# EAGLE design mbed-WiFi-BLE-Cloud-v1.1.0 (EAGLE 7.7.0)

## Sheet 1 of 4
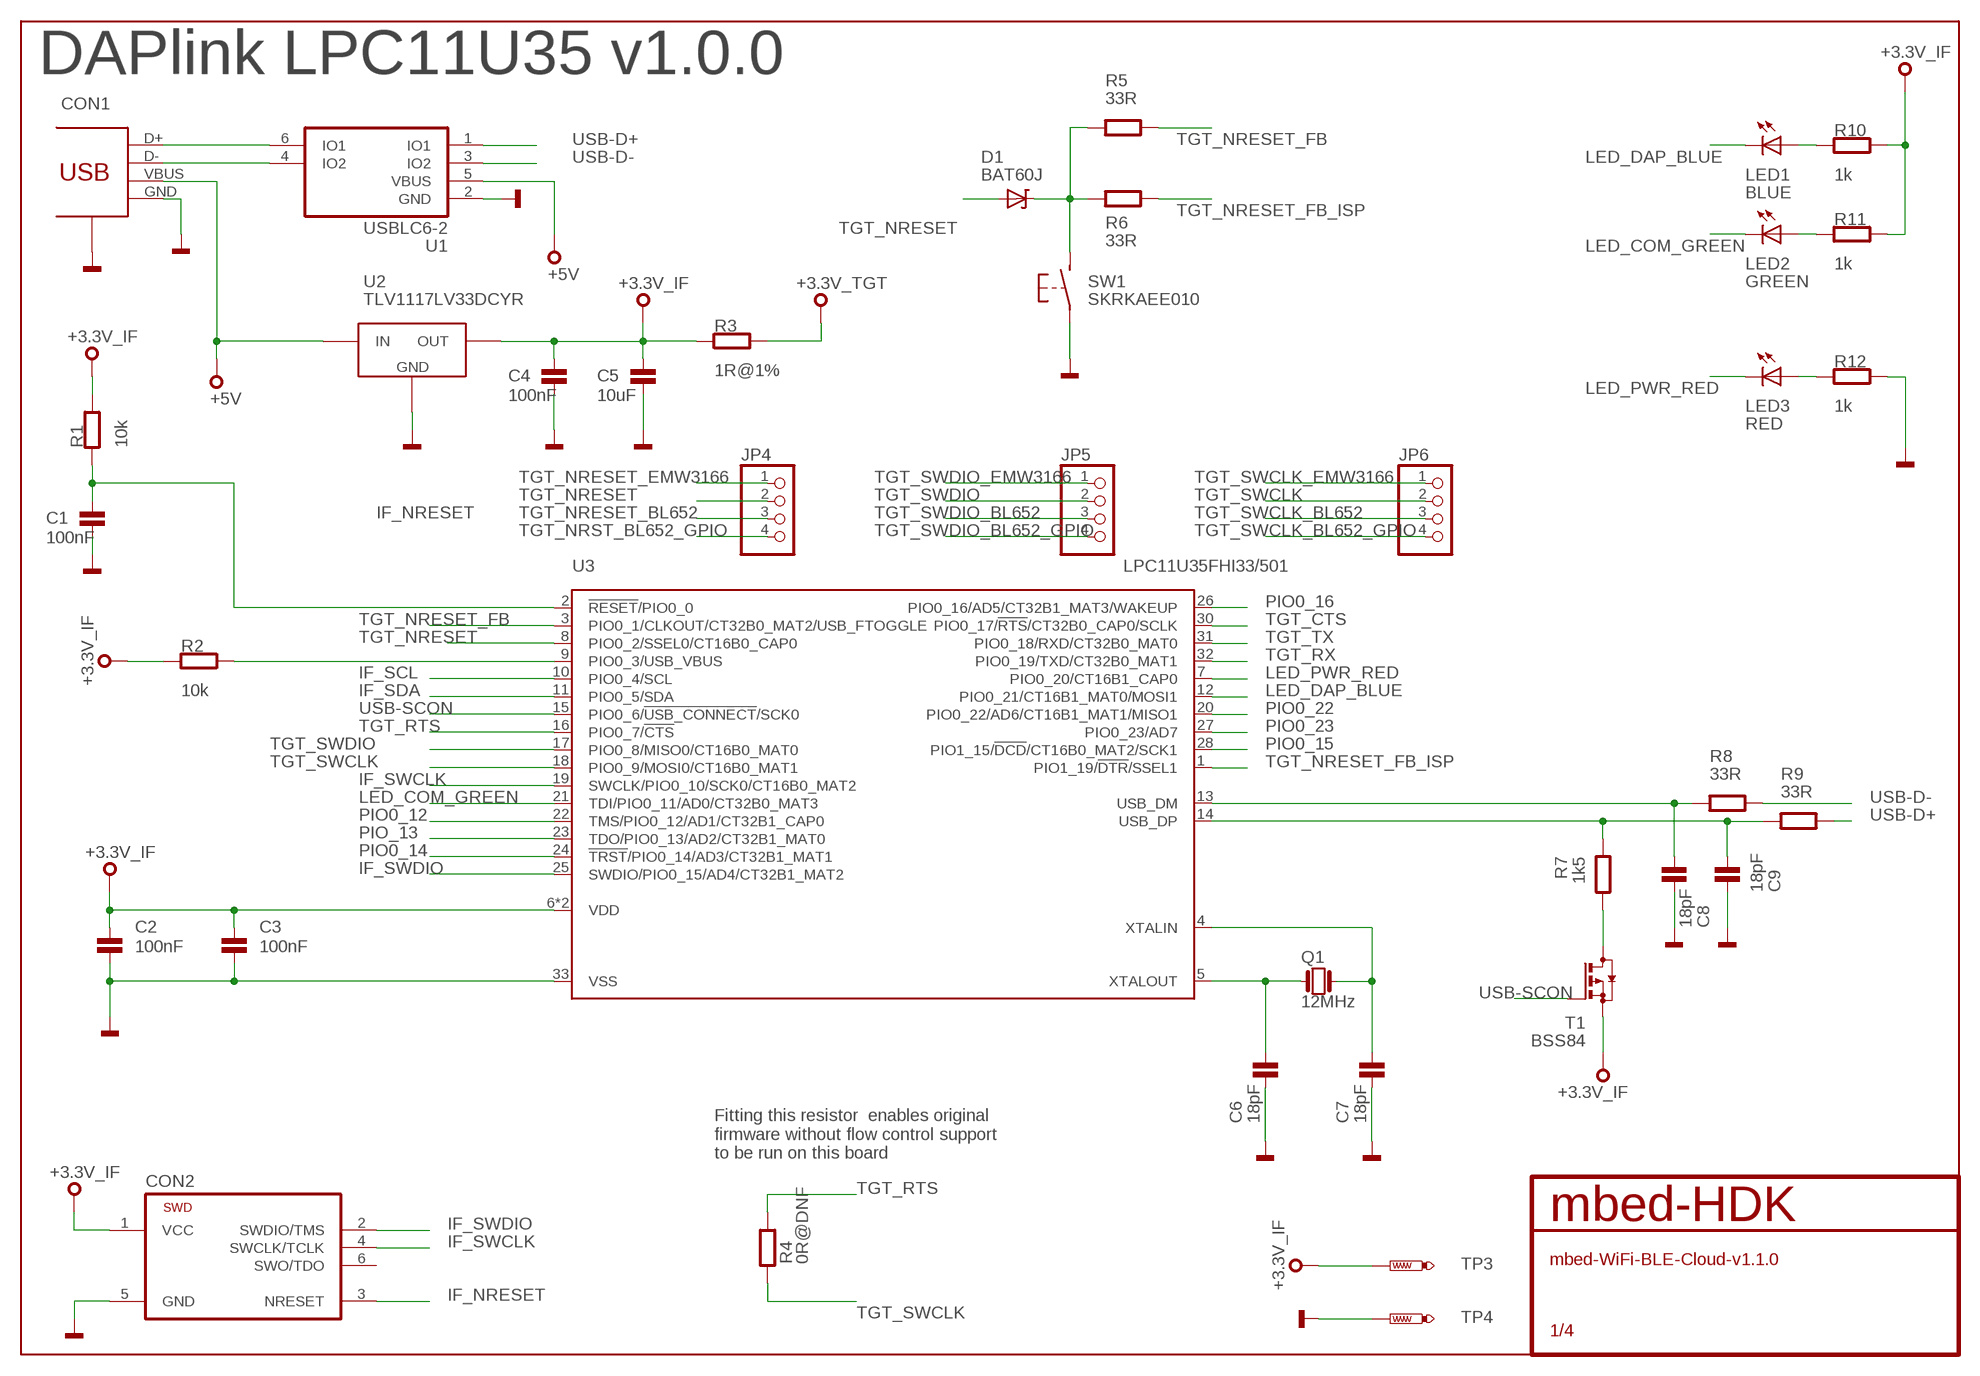
[diagram p0: schematic, sheet 1]

### Parts
C1  100nF  C0603  [0603]
C2  100nF  C0603  [0603]
C3  100nF  C0603  [0603]
C4  100nF  C0603  [0603]
C5  10uF  C0603  [0603]
C6  18pF  C0603  [0603]
C7  18pF  C0603  [0603]
C8  18pF  C0603  [0603]
C9  18pF  C0603  [0603]
CON1  47346-0001  [USB-MICRO-B-H]
CON2  TC2030-CTX-NL  [TC2030-CTX-NL]
D1  BAT60J  [SOD323]
JP4  PINHD-1X4  [1X04]
JP5  PINHD-1X4  [1X04]
JP6  PINHD-1X4  [1X04]
LED1  BLUE  LED0603  [CHIPLED_0603]
LED2  GREEN  LED0603  [CHIPLED_0603]
LED3  RED  LED0603  [CHIPLED_0603]
Q1  12MHz  Q_3.2X2.5  [3.2X2.5]
R1  10k  R0603  [0603]
R2  10k  R0603  [0603]
R3  1R@1%  R0603  [0603]
R4  0R@DNF  R0603  [0603]
R5  33R  R0603  [0603]
R6  33R  R0603  [0603]
R7  1k5  R0603  [0603]
R8  33R  R0603  [0603]
R9  33R  R0603  [0603]
R10  1k  R0603  [0603]
R11  1k  R0603  [0603]
R12  1k  R0603  [0603]
SW1  SKRKAEE010  [SKRKAEE010]
T1  BSS84  [SOT23-3]
TP3  PTR1PAD1-13  [P1-13]
TP4  PTR1PAD1-13  [P1-13]
U1  USBLC6-2SC6  [SOT23-6L]
U2  TLV1117LV33DCYR  [SOT223]
U3  LPC11U35FHI33/501  [SOT617-3]

### Nets
+3.3V_IF: C2.1 C3.1 C4.1 C5.1 CON2.1(VCC) R1.2 R2.1 R3.1 R10.2 R11.2 T1.2(S) TP3.TP U2.2(OUT) U2.4(OUT) U3.6(VDD) U3.29(VDD) ; also sheet 4
+3.3V_TGT: R3.2 ; also sheet 2,3,4
+5V: CON1.VBUS U1.5(VBUS) U2.3(IN) ; also sheet 4
GND: C1.2 C2.2 C3.2 C4.2 C5.2 C6.2 C7.2 C8.2 C9.2 CON1.GND CON1.GND1(SHEILD) CON1.GND2(SHEILD) CON1.GND3(SHEILD) CON1.GND4(SHEILD) CON2.5(GND) R12.2 SW1.P$1(P) TP4.TP U1.2(GND) U2.1(GND) U3.33(VSS) ; also sheet 2,3,4
IF_NRESET: C1.1 CON2.3(NRESET) R1.1 U3.2(!RESET!/PIO0_0)
IF_SCL: U3.10(PIO0_4/SCL) ; also sheet 4
IF_SDA: U3.11(PIO0_5/SDA) ; also sheet 4
IF_SWCLK: CON2.4(SWCLK/TCLK) U3.19(SWCLK/PIO0_10/SCK0/CT16B0_MAT2)
IF_SWDIO: CON2.2(SWDIO/TMS) U3.25(SWDIO/PIO0_15/AD4/CT32B1_MAT2)
LED_COM_GREEN: LED2.C U3.21(TDI/PIO0_11/AD0/CT32B0_MAT3)
LED_DAP_BLUE: LED1.C U3.12(PIO0_21/CT16B1_MAT0/MOSI1)
LED_PWR_RED: LED3.C U3.7(PIO0_20/CT16B1_CAP0)
N$3: C7.1 Q1.P$3 U3.4(XTALIN)
N$10: R7.1 T1.3(D)
N$12: CON1.D+ U1.6(IO1)
N$13: CON1.D- U1.4(IO2)
N$18: C6.1 Q1.P$1 U3.5(XTALOUT)
N$21: R2.2 U3.9(PIO0_3/USB_VBUS)
N$24: LED2.A R11.1
N$25: LED1.A R10.1
N$26: LED3.A R12.1
PIO0_12: U3.22(TMS/PIO0_12/AD1/CT32B1_CAP0)
PIO0_14: U3.24(!TRST!/PIO0_14/AD3/CT32B1_MAT1)
PIO0_15: U3.28(PIO1_15/!DCD!/CT16B0_MAT2/SCK1)
PIO0_16: U3.26(PIO0_16/AD5/CT32B1_MAT3/WAKEUP)
PIO0_22: U3.20(PIO0_22/AD6/CT16B1_MAT1/MISO1)
PIO0_23: U3.27(PIO0_23/AD7)
PIO_13: U3.23(TDO/PIO0_13/AD2/CT32B1_MAT0)
TGT_CTS: U3.30(PIO0_17/!RTS!/CT32B0_CAP0/SCLK)
TGT_NRESET: D1.A JP4.2 U3.8(PIO0_2/SSEL0/CT16B0_CAP0)
TGT_NRESET_BL652: JP4.3 ; also sheet 3
TGT_NRESET_BUTTON: D1.K R5.2 R6.2 SW1.P$2(S)
TGT_NRESET_EMW3166: JP4.1 ; also sheet 2
TGT_NRESET_FB: R5.1 U3.3(PIO0_1/CLKOUT/CT32B0_MAT2/USB_FTOGGLE)
TGT_NRESET_FB_ISP: R6.1 U3.1(PIO1_19/!DTR!/SSEL1)
TGT_NRST_BL652_GPIO: JP4.4 ; also sheet 2
TGT_RTS: R4.2 U3.16(PIO0_7/!CTS!)
TGT_RX: U3.32(PIO0_19/TXD/CT32B0_MAT1) ; also sheet 2
TGT_SWCLK: JP6.2 R4.1 U3.18(PIO0_9/MOSI0/CT16B0_MAT1)
TGT_SWCLK_BL652: JP6.3 ; also sheet 3
TGT_SWCLK_BL652_GPIO: JP6.4 ; also sheet 2
TGT_SWCLK_EMW3166: JP6.1 ; also sheet 2
TGT_SWDIO: JP5.2 U3.17(PIO0_8/MISO0/CT16B0_MAT0)
TGT_SWDIO_BL652: JP5.3 ; also sheet 3
TGT_SWDIO_BL652_GPIO: JP5.4 ; also sheet 2
TGT_SWDIO_EMW3166: JP5.1 ; also sheet 2
TGT_TX: U3.31(PIO0_18/RXD/CT32B0_MAT0) ; also sheet 2
USB-D+: R9.1 U1.1(IO1)
USB-D-: R8.1 U1.3(IO2)
USB-SCON: T1.1(G) U3.15(PIO0_6/!USB_CONNECT!/SCK0)
USB_DM: C8.1 R8.2 U3.13(USB_DM)
USB_DP: C9.1 R7.2 R9.2 U3.14(USB_DP)
Unconnected: CON2.6(SWO/TDO)

### Notes on the sheet
- DAPlink LPC11U35 v1.0.0
- Fitting this resistor  enables original
  firmware without flow control support
  to be run on this board

## Sheet 2 of 4
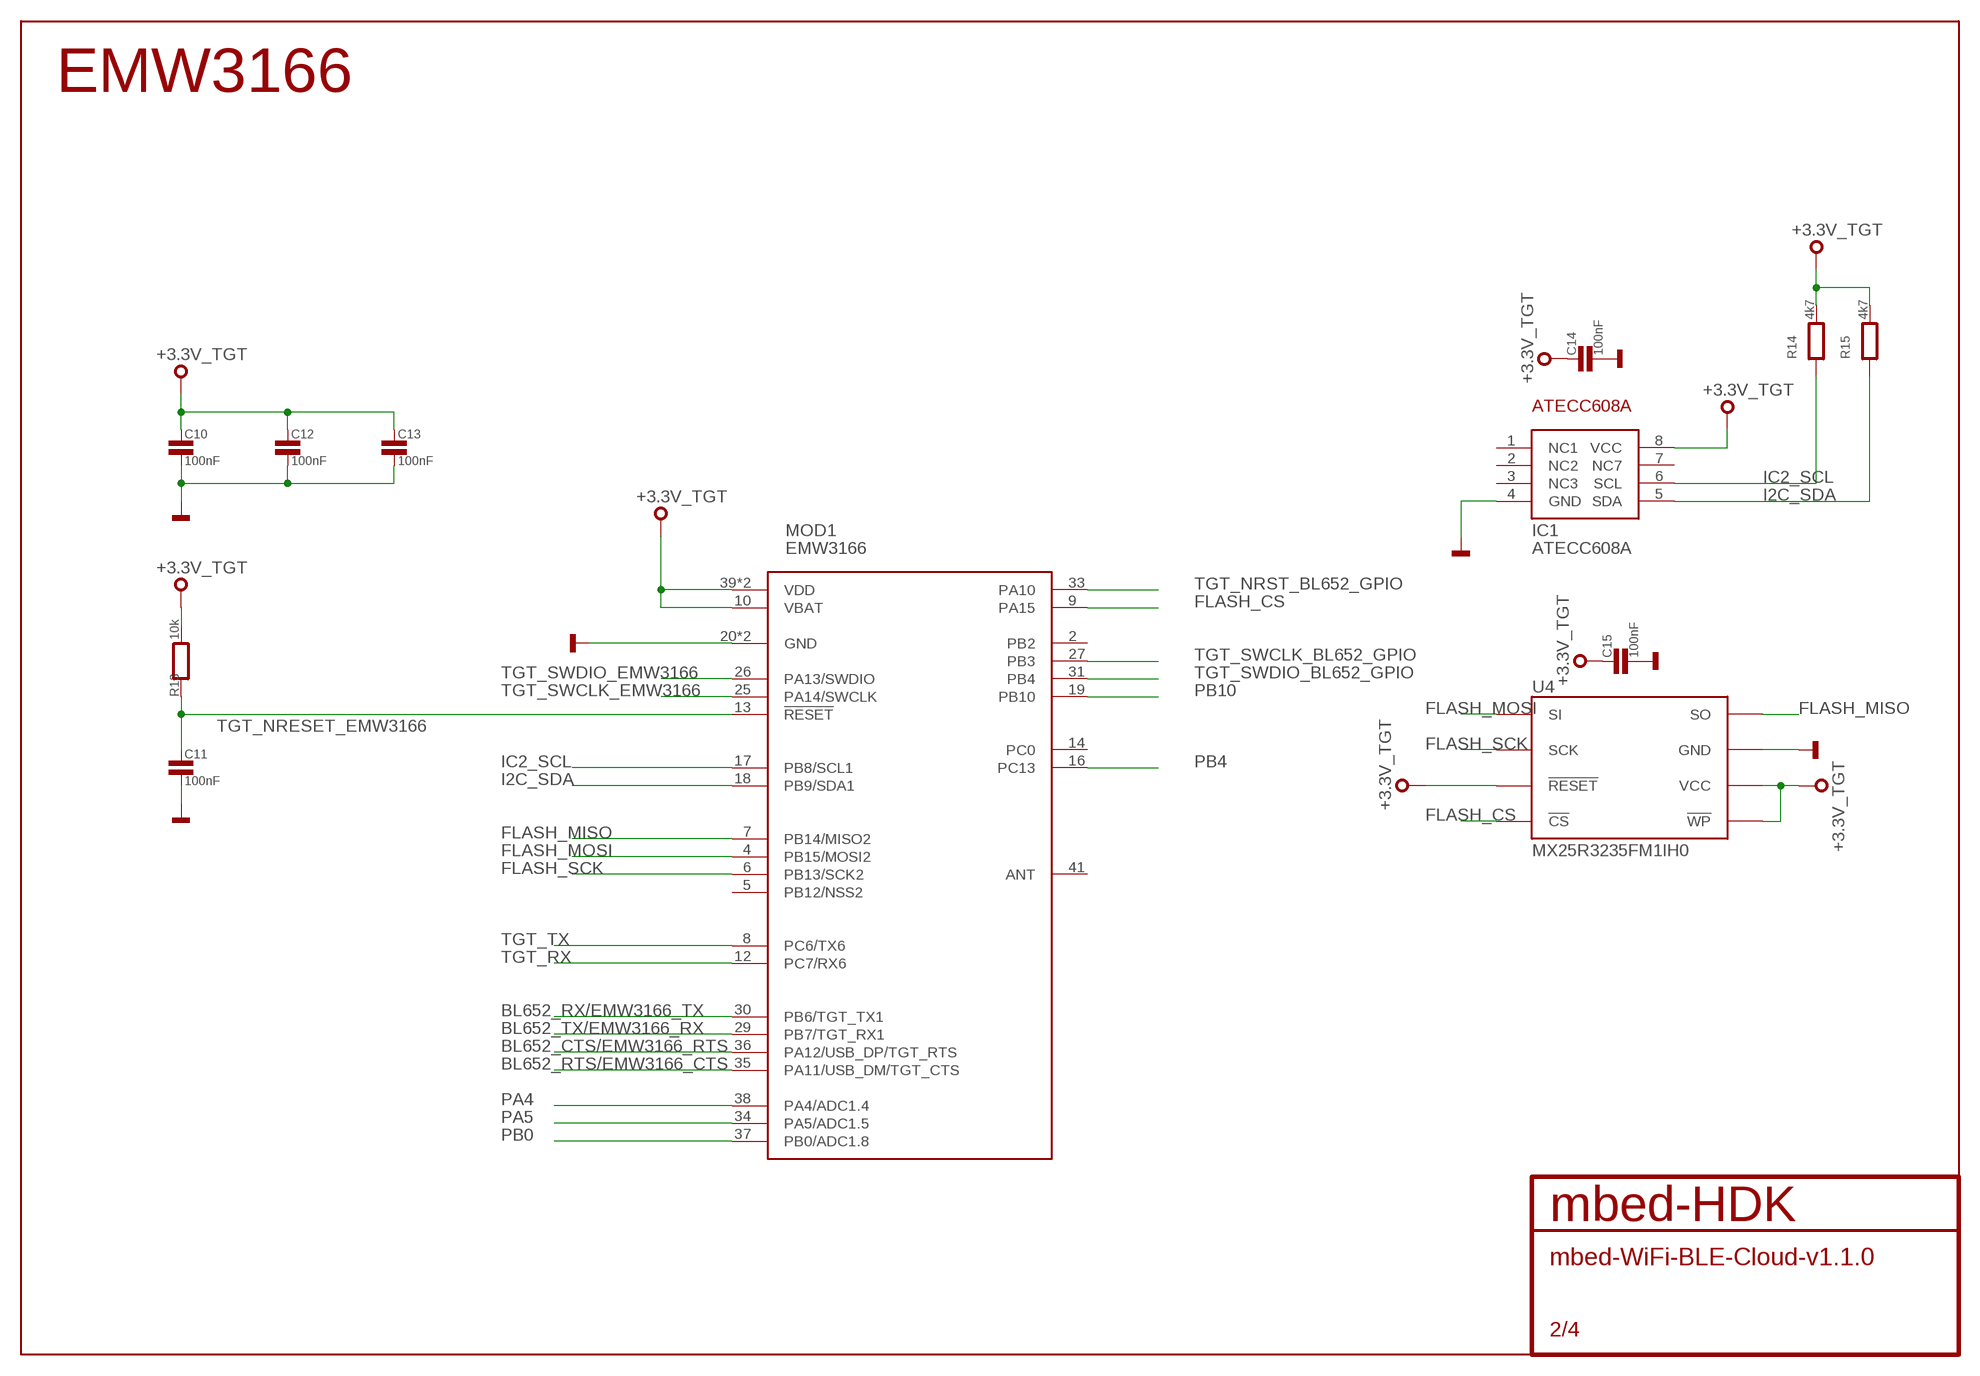
[diagram p1: schematic, sheet 2]

### Parts
C10  100nF  C0603  [0603]
C11  100nF  C0603  [0603]
C12  100nF  C0603  [0603]
C13  100nF  C0603  [0603]
C14  100nF  C0603  [0603]
C15  100nF  C0603  [0603]
IC1  ATECC608A  [SO8]
MOD1  EMW3166  [EMW3166]
R13  10k  R0603  [0603]
R14  4k7  R0603  [0603]
R15  4k7  R0603  [0603]
U4  MX25R3235FM1IH0  [SO8]

### Nets
+3.3V_TGT: C10.1 C12.1 C13.1 C14.1 C15.1 IC1.8(VCC) MOD1.10(VBAT) MOD1.39(VDD) MOD1.40(VDD) R13.2 R14.2 R15.2 U4.3(!WP) U4.7(!RESET) U4.8(VCC) ; also sheet 1,3,4
BL652_CTS/EMW3166_RTS: MOD1.36(PA12/USB_DP/TGT_RTS) ; also sheet 3
BL652_RTS/EMW3166_CTS: MOD1.35(PA11/USB_DM/TGT_CTS) ; also sheet 3
BL652_RX/EMW3166_TX: MOD1.30(PB6/TGT_TX1) ; also sheet 3
BL652_TX/EMW3166_RX: MOD1.29(PB7/TGT_RX1) ; also sheet 3
FLASH_CS: MOD1.9(PA15) U4.1(!CS)
FLASH_MISO: MOD1.7(PB14/MISO2) U4.2(SO)
FLASH_MOSI: MOD1.4(PB15/MOSI2) U4.5(SI)
FLASH_SCK: MOD1.6(PB13/SCK2) U4.6(SCK)
GND: C10.2 C11.2 C12.2 C13.2 C14.2 C15.2 IC1.4(GND) MOD1.20(GND) MOD1.21(GND) U4.4(GND) ; also sheet 1,3,4
I2C_SDA: IC1.5(SDA) MOD1.18(PB9/SDA1) R15.1 ; also sheet 3,4
IC2_SCL: IC1.6(SCL) MOD1.17(PB8/SCL1) R14.1 ; also sheet 3,4
PA4: MOD1.38(PA4/ADC1.4) ; also sheet 4
PA5: MOD1.34(PA5/ADC1.5) ; also sheet 4
PB0: MOD1.37(PB0/ADC1.8) ; also sheet 4
PB4: MOD1.16(PC13) ; also sheet 4
PB10: MOD1.19(PB10) ; also sheet 4
TGT_NRESET_EMW3166: C11.1 MOD1.13(!RESET) R13.1 ; also sheet 1
TGT_NRST_BL652_GPIO: MOD1.33(PA10) ; also sheet 1
TGT_RX: MOD1.12(PC7/RX6) ; also sheet 1
TGT_SWCLK_BL652_GPIO: MOD1.27(PB3) ; also sheet 1
TGT_SWCLK_EMW3166: MOD1.25(PA14/SWCLK) ; also sheet 1
TGT_SWDIO_BL652_GPIO: MOD1.31(PB4) ; also sheet 1
TGT_SWDIO_EMW3166: MOD1.26(PA13/SWDIO) ; also sheet 1
TGT_TX: MOD1.8(PC6/TX6) ; also sheet 1
Unconnected: IC1.1(NC1) IC1.2(NC2) IC1.3(NC3) IC1.7(NC7) MOD1.2(PB2) MOD1.5(PB12/NSS2) MOD1.14(PC0) MOD1.41(ANT)

### Notes on the sheet
- EMW3166

## Sheet 3 of 4
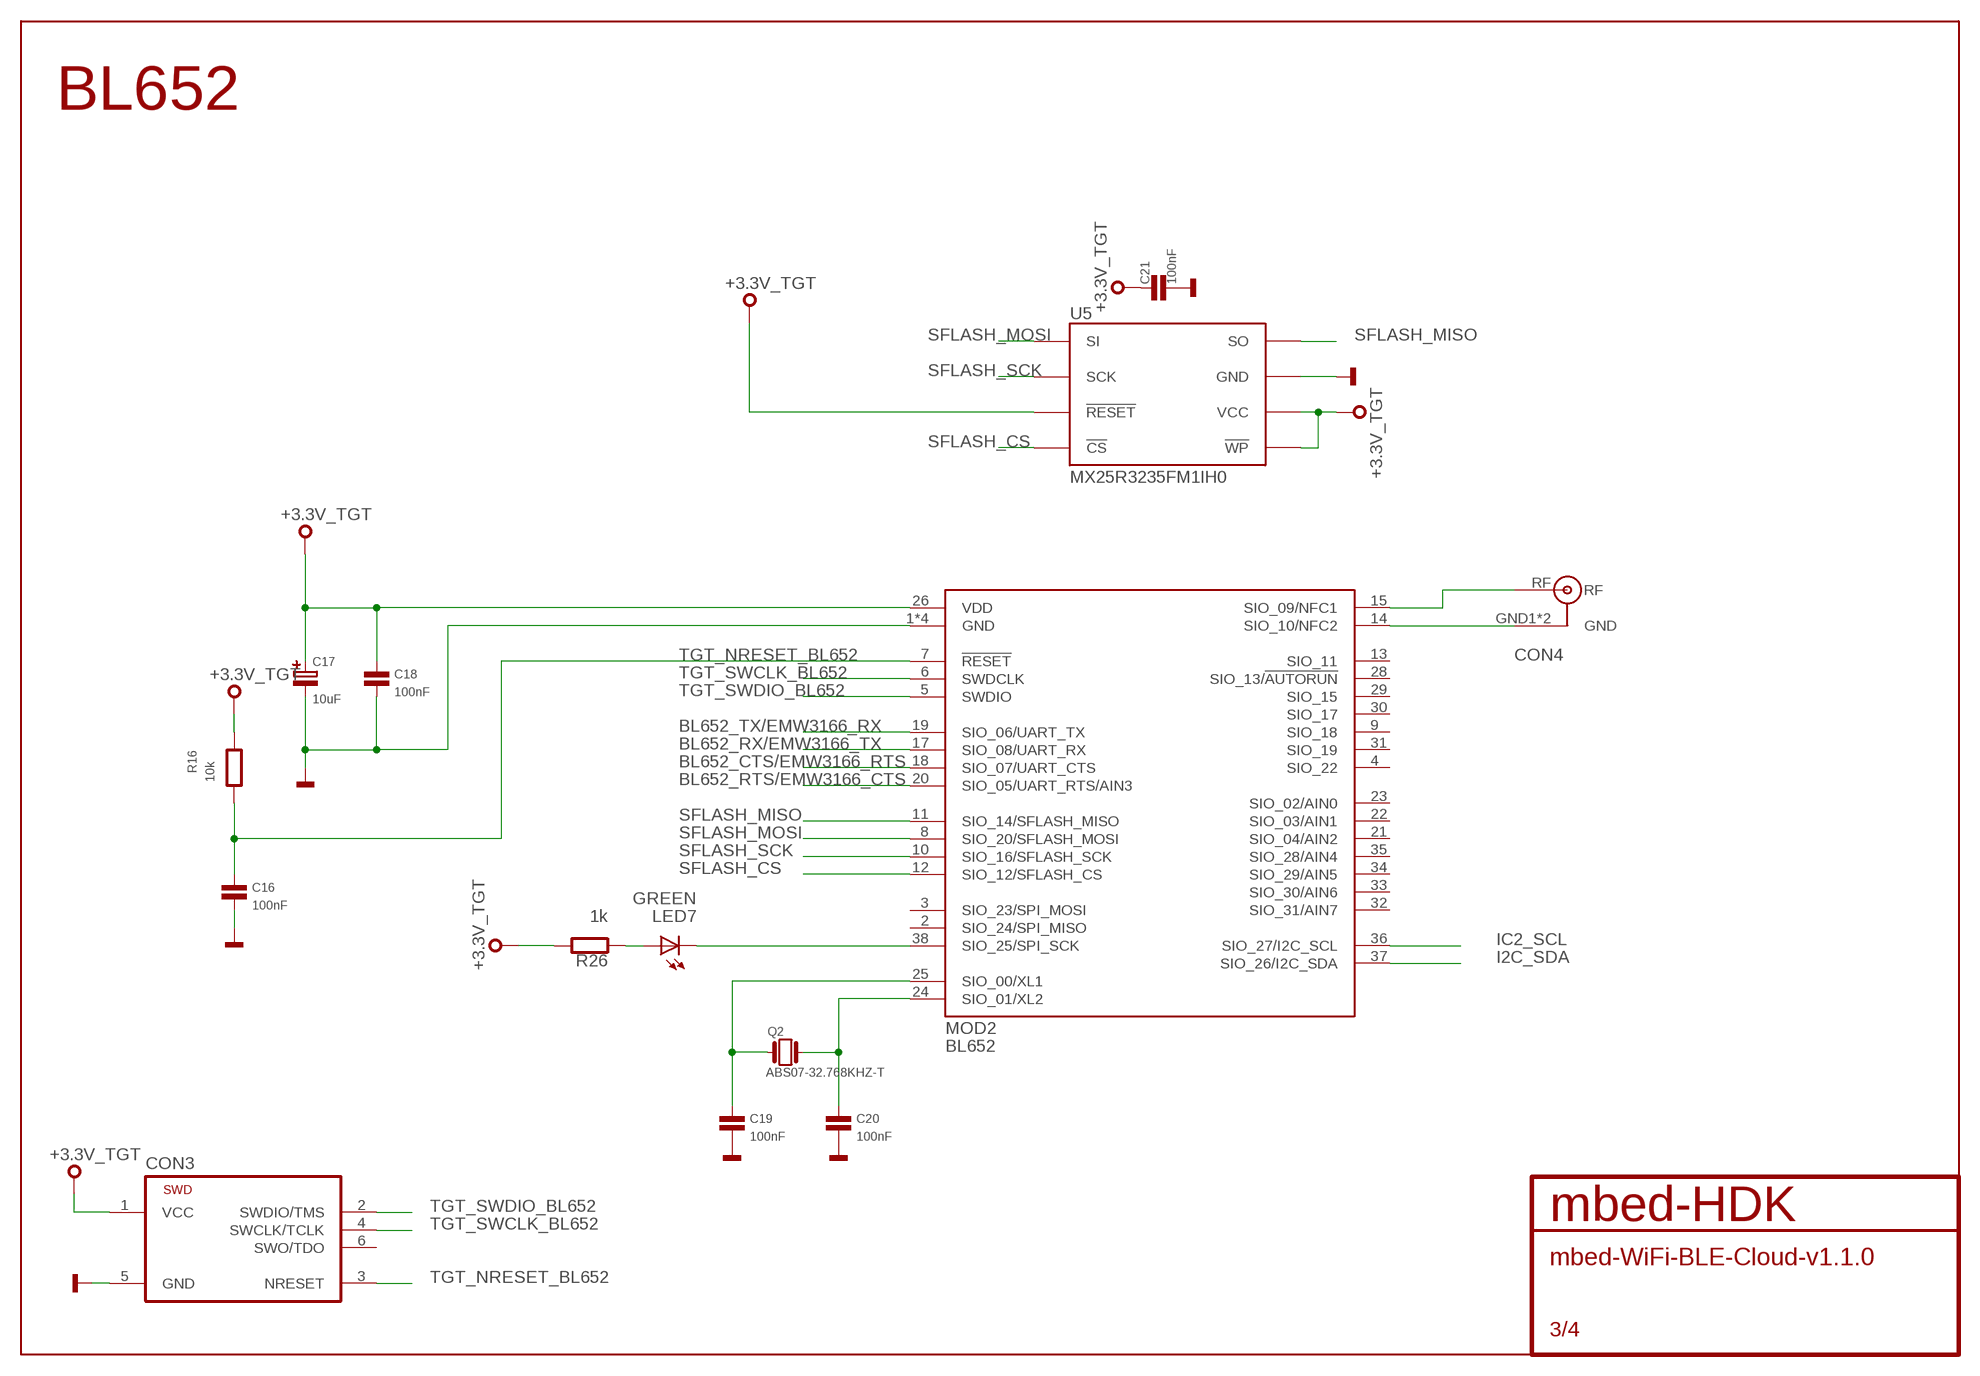
[diagram p2: schematic, sheet 3]

### Parts
C16  100nF  C0603  [0603]
C17  10uF  C-POLB  [SMC_B]
C18  100nF  C0603  [0603]
C19  100nF  C0603  [0603]
C20  100nF  C0603  [0603]
C21  100nF  C0603  [0603]
CON3  TC2030-CTX-NL  [TC2030-CTX-NL]
CON4  U.FL  [U.FL-R-SMT-1]
LED7  GREEN  LED0603  [CHIPLED_0603]
MOD2  BL652  [BL652]
Q2  ABS07-32.768KHZ-T  [FC135]
R16  10k  R0603  [0603]
R26  1k  R0603  [0603]
U5  MX25R3235FM1IH0  [SO8]

### Nets
+3.3V_TGT: C17.+ C18.1 C21.1 CON3.1(VCC) MOD2.26(VDD) R16.2 R26.2 U5.3(!WP) U5.7(!RESET) U5.8(VCC) ; also sheet 1,2,4
BL652_CTS/EMW3166_RTS: MOD2.18(SIO_07/UART_CTS) ; also sheet 2
BL652_RTS/EMW3166_CTS: MOD2.20(SIO_05/UART_RTS/AIN3) ; also sheet 2
BL652_RX/EMW3166_TX: MOD2.17(SIO_08/UART_RX) ; also sheet 2
BL652_TX/EMW3166_RX: MOD2.19(SIO_06/UART_TX) ; also sheet 2
GND: C16.2 C17.- C18.2 C19.2 C20.2 C21.2 CON3.5(GND) MOD2.1(GND) MOD2.16(GND) MOD2.27(GND) MOD2.39(GND) U5.4(GND) ; also sheet 1,2,4
I2C_SDA: MOD2.37(SIO_26/I2C_SDA) ; also sheet 2,4
IC2_SCL: MOD2.36(SIO_27/I2C_SCL) ; also sheet 2,4
N$1: CON4.RF MOD2.15(SIO_09/NFC1)
N$6: CON4.GND1(GND) CON4.GND2(GND) MOD2.14(SIO_10/NFC2)
N$7: LED7.A R26.1
N$8: LED7.C MOD2.38(SIO_25/SPI_SCK)
N$19: C20.1 MOD2.24(SIO_01/XL2) Q2.X2
N$20: C19.1 MOD2.25(SIO_00/XL1) Q2.X1
SFLASH_CS: MOD2.12(SIO_12/SFLASH_CS) U5.1(!CS)
SFLASH_MISO: MOD2.11(SIO_14/SFLASH_MISO) U5.2(SO)
SFLASH_MOSI: MOD2.8(SIO_20/SFLASH_MOSI) U5.5(SI)
SFLASH_SCK: MOD2.10(SIO_16/SFLASH_SCK) U5.6(SCK)
TGT_NRESET_BL652: C16.1 CON3.3(NRESET) MOD2.7(!RESET) R16.1 ; also sheet 1
TGT_SWCLK_BL652: CON3.4(SWCLK/TCLK) MOD2.6(SWDCLK) ; also sheet 1
TGT_SWDIO_BL652: CON3.2(SWDIO/TMS) MOD2.5(SWDIO) ; also sheet 1
Unconnected: CON3.6(SWO/TDO) MOD2.2(SIO_24/SPI_MISO) MOD2.3(SIO_23/SPI_MOSI) MOD2.4(SIO_22) MOD2.9(SIO_18) MOD2.13(SIO_11) MOD2.21(SIO_04/AIN2) MOD2.22(SIO_03/AIN1) MOD2.23(SIO_02/AIN0) MOD2.28(SIO_13/!AUTORUN) MOD2.29(SIO_15) MOD2.30(SIO_17) MOD2.31(SIO_19) MOD2.32(SIO_31/AIN7) MOD2.33(SIO_30/AIN6) MOD2.34(SIO_29/AIN5) MOD2.35(SIO_28/AIN4)

### Notes on the sheet
- BL652

## Sheet 4 of 4
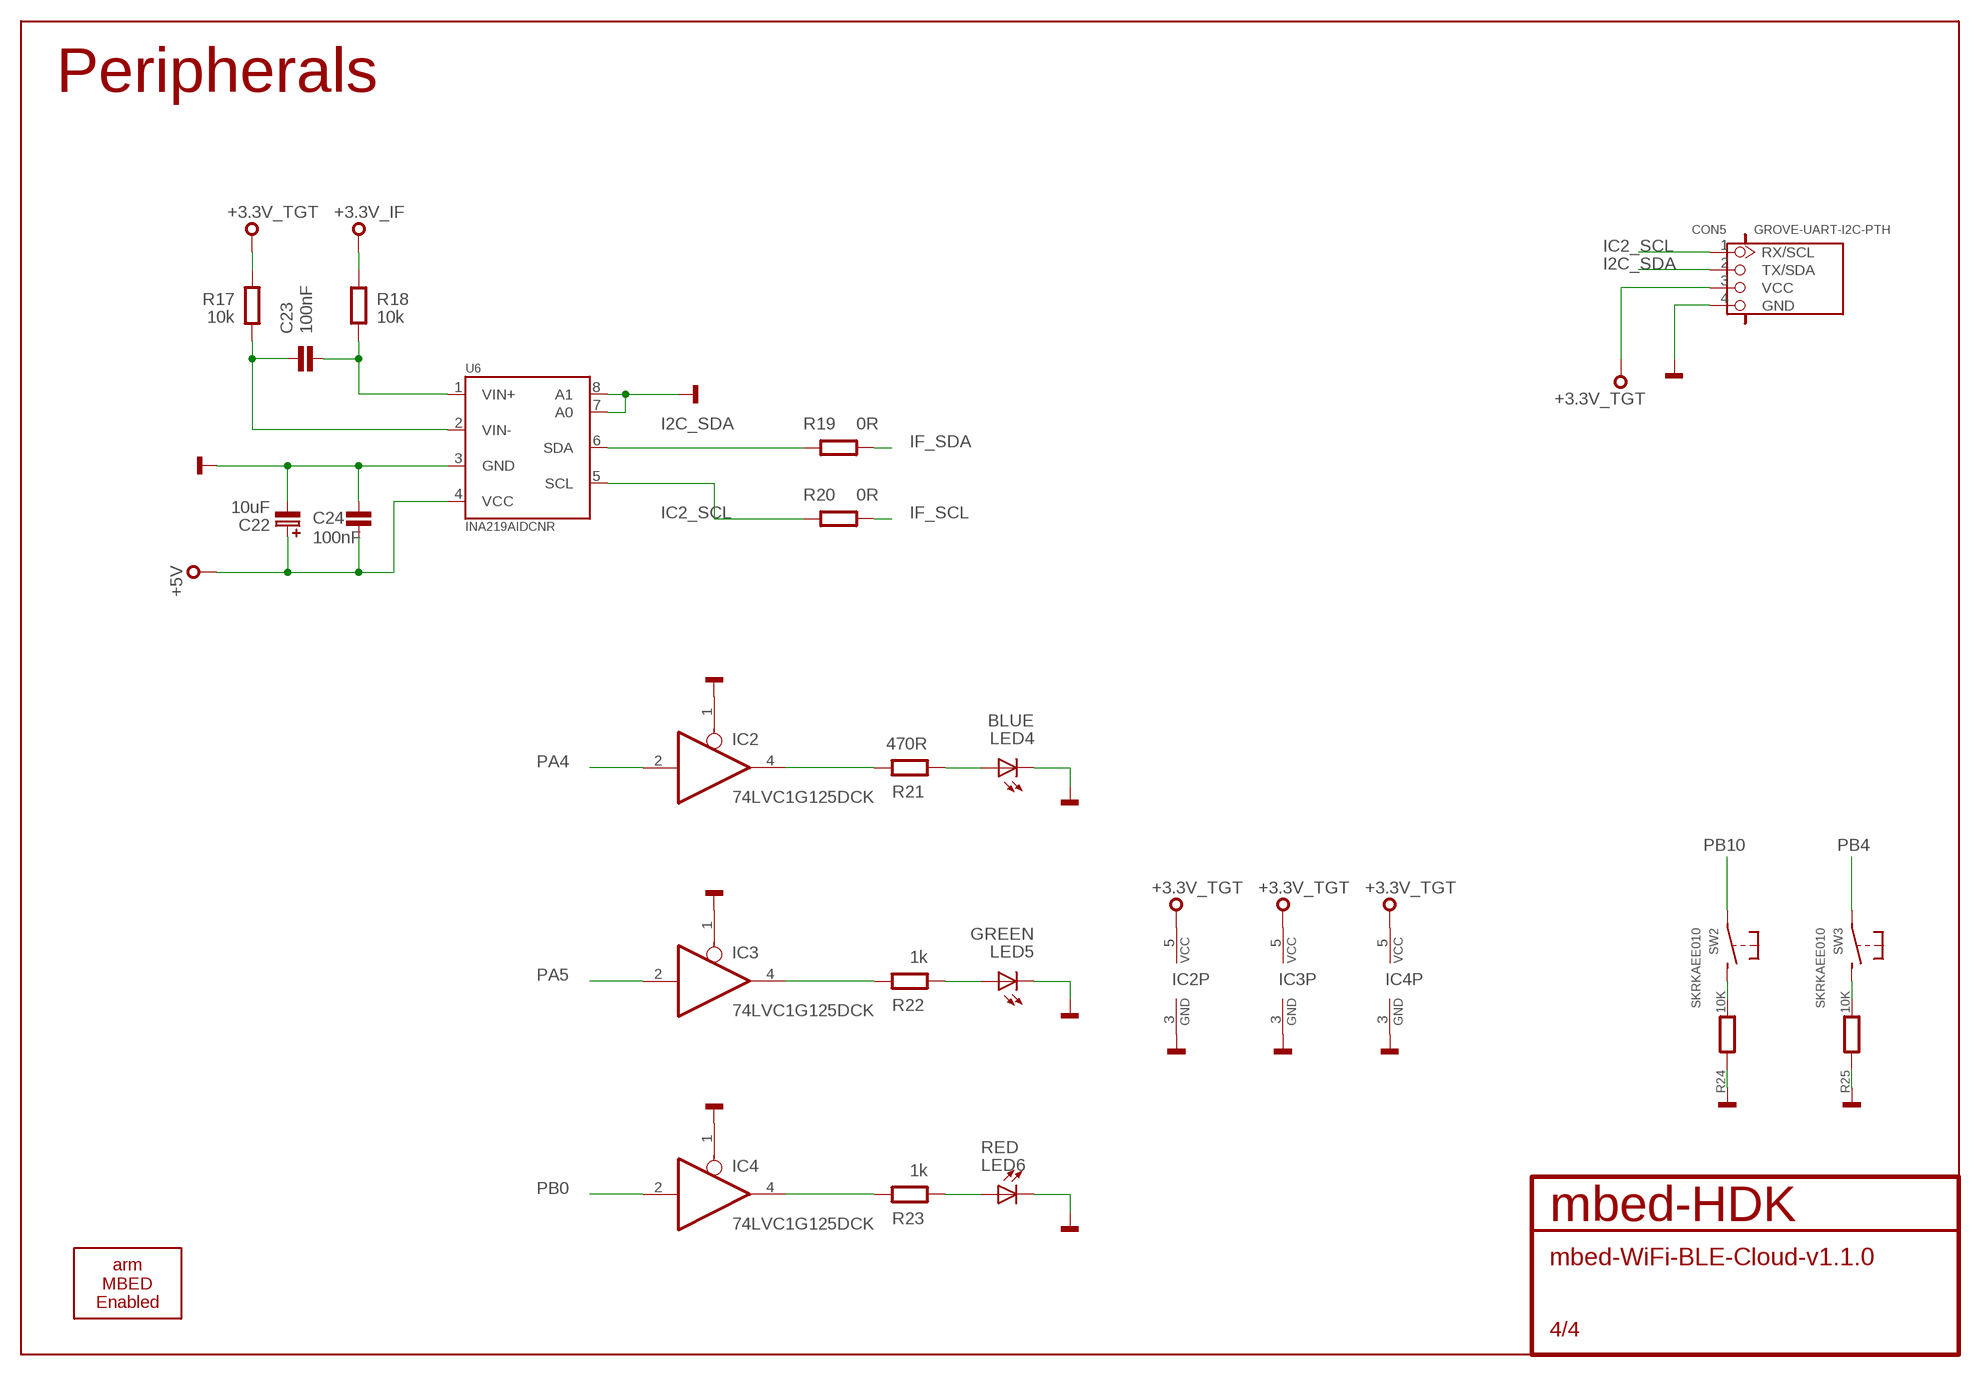
[diagram p3: schematic, sheet 4]

### Parts
C22  10uF  C-POLB  [SMC_B]
C23  100nF  C0603  [0603]
C24  100nF  C0603  [0603]
CON5  GROVE-UART-I2C-PTH  [HW4-2.0]
IC2  74LVC1G125DCK  [SC70-5]
IC3  74LVC1G125DCK  [SC70-5]
IC4  74LVC1G125DCK  [SC70-5]
LED4  BLUE  LED0603  [CHIPLED_0603]
LED5  GREEN  LED0603  [CHIPLED_0603]
LED6  RED  LED0603  [CHIPLED_0603]
R17  10k  R0603  [0603]
R18  10k  R0603  [0603]
R19  0R  R0603  [0603]
R20  0R  R0603  [0603]
R21  470R  R0603  [0603]
R22  1k  R0603  [0603]
R23  1k  R0603  [0603]
R24  10K  R0603  [0603]
R25  10K  R0603  [0603]
SS1  ARM-MBED-ENABLED-12MM  [ARM-MBED-ENABLED-12MM]
SW2  SKRKAEE010  [SKRKAEE010]
SW3  SKRKAEE010  [SKRKAEE010]
U6  INA219AIDCNR  [SOT23-8]

### Nets
+3.3V_IF: R18.2 ; also sheet 1
+3.3V_TGT: CON5.3(VCC) IC2.5(VCC) IC3.5(VCC) IC4.5(VCC) R17.2 ; also sheet 1,2,3
+5V: C22.+ C24.2 U6.4(VCC) ; also sheet 1
GND: C22.- C24.1 CON5.4(GND) IC2.1(OE) IC2.3(GND) IC3.1(OE) IC3.3(GND) IC4.1(OE) IC4.3(GND) LED4.C LED5.C LED6.C R24.1 R25.1 U6.3(GND) U6.7(A0) U6.8(A1) ; also sheet 1,2,3
I2C_SDA: CON5.2(TX/SDA) R19.2 U6.6(SDA) ; also sheet 2,3
IC2_SCL: CON5.1(RX/SCL) R20.2 U6.5(SCL) ; also sheet 2,3
IF_SCL: R20.1 ; also sheet 1
IF_SDA: R19.1 ; also sheet 1
N$2: LED5.A R22.2
N$4: IC4.4(O) R23.1
N$5: LED6.A R23.2
N$9: IC3.4(O) R22.1
N$11: IC2.4(O) R21.1
N$14: LED4.A R21.2
N$15: C23.2 R17.1 U6.2(VIN-)
N$17: C23.1 R18.1 U6.1(VIN+)
N$22: R25.2 SW3.P$2(S)
N$23: R24.2 SW2.P$2(S)
PA4: IC2.2(I) ; also sheet 2
PA5: IC3.2(I) ; also sheet 2
PB0: IC4.2(I) ; also sheet 2
PB4: SW3.P$1(P) ; also sheet 2
PB10: SW2.P$1(P) ; also sheet 2

### Notes on the sheet
- Peripherals

## Library data of the parts
C1-C15 C21 = mbed-HDK-RLC:C: Capacitor
C16 C18-C20 C23 C24 = mbed-HDK:C: Capacitor
C17 C22 = mbed-HDK-RLC:C-POL: Polarised capacitor; MF: Kemet; MFN: T491B106K020AT; OC-DIGIKEY: 399-8298-1-ND; OC-MOUSER: 80-T491B106K020; OC-NEWARK: 57K1740
CON1 = mbed-HDK-Connector:47346-0001: USB Receptacle Horizontal Micro Type B; MF: MOLEX; MFN: 47346-0001; OC-DIGIKEY: WM17141CT-ND; OC-MOUSER: 538-47346-0001; OC-NEWARK: 1568026
CON2 CON3 = mbed-HDK-Connector:TC2030-CTX: Tag-Connect In Circuit Programming & Debug Cable 6 Pin
CON4 = mbed-HDK-Connector:U.FL; MF: Hirose; MFN: U.FL-R-SMT-1; OC-DIGIKEY: H9161CT-ND; OC-MOUSER: 798-U.FL-R-SMT-110; OC-NEWARK: 1688077
CON5 = Treadstone:GROVE-UART-I2C-PTH
D1 = mbed-HDK-Discrete:BAT60J: SCHOTTKY DIODE; MF: STMicroelectronics; MFN: BAT60JFILM; OC-DIGIKEY: 497-3707-6-ND; OC-MOUSER: 511-BAT60JFILM; OC-NEWARK: 89K1218
IC1 = blackbriar:ATECC608A
IC2-IC4 = 74xx-little-us:74*1G125: Single Bus Buffer Gate with 3-State Output
JP4-JP6 = mbed-HDK-Connector:PINHD-1X4: PIN HEADER
LED1-LED3 LED7 = mbed-HDK-Optical:LED: LED SMD
LED4-LED6 = mbed-HDK:LED: SMD LED
MOD1 = blackbriar:EMW3166
MOD2 = blackbriar:BL652
Q1 = mbed-HDK-Oscillator:Q: Generic Crystal
Q2 = mbed-HDK-Oscillator:ABS07-32.768KHZ-T: Crystal, Abracon 32.768kHz ±20ppm 12.5pF; MF: Abracon; MFN: ABS07-32.768KHZ-T; OC-DIGIKEY: 535-9542-1-ND; OC-MOUSER: 535-9542-1-ND; OC-NEWARK: 2101347
R1-R26 = mbed-HDK-RLC:R: Resistor
SS1 = mbed-HDK-misc-Silkscreen:ARM-MBED-ENABLED
SW1-SW3 = mbed-HDK-Switch:SKRKAEE010: MOMENTARY SWITCH PUSH VERTICAL (SPST); MF: ALPS; MFN: SKRKAEE010; OC-MOUSER: 688-SKRKAE
T1 = mbed-HDK-Discrete:BSS84: MOSFET P-CHANNEL; MF: Fairchild Semiconductor; MFN: BSS84; OC-DIGIKEY: BSS84CT-ND; OC-MOUSER: 512-BSS84; OC-NEWARK: 58K8770
TP3 TP4 = mbed-HDK-Test:PTR1: TEST PIN
U1 = mbed-HDK-IC:USBLC6-2: 2 line Transient voltage suppressor; MF: STMicro; MFN: USBLC6-2SC6Y; OC-DIGIKEY: 497-11882-1-ND; OC-MOUSER: 511-USBLC6-2SC6Y; OC-NEWARK: 2629711
U2 = mbed-HDK-Power:TLV1117LV33DCYR: LDO Fixed Regulator 3.3v, 1A; MF: Texas Instruments; MFN: TLV1117LV33DCYR; OC-DIGIKEY: 296-28778-1-ND; OC-MOUSER: 595-TLV1117LV33DCYR; OC-NEWARK: 2323647
U3 = mbed-HDK-MF-NXP:LPC11U35FHI33: 32 Bit Microcontroller, ARM Cortex-M0, 50 MHz, 64 KB, 12 KB, 33 Pins, HVQFN; MF: NXP; MFN: LPC11U35FHI33/501; OC-DIGIKEY: 568-9586-ND; OC-MOUSER: 771-LPC11U35FHI33501; OC-NEWARK: 2115658
U4 U5 = blackbriar:MX25R3235FM1IH0: Serial Flash 32 Mb 80 Mhz; MF: Macronix; MFN: MX25R3235FM2IH0; OC-DIGIKEY: 1092-1174-ND
U6 = mbed-HDK-IC:INA219AIDCNR: Current Sense - I2C Bi-Directional CURRENT/POWER MONITOR with I2C Interface; MF: Texas Instruments; MFN: INA219AIDCNR; OC-DIGIKEY: 296-23770-1-ND; OC-MOUSER: 595-INA219AIDCNR; OC-NEWARK: 2295989

## Board
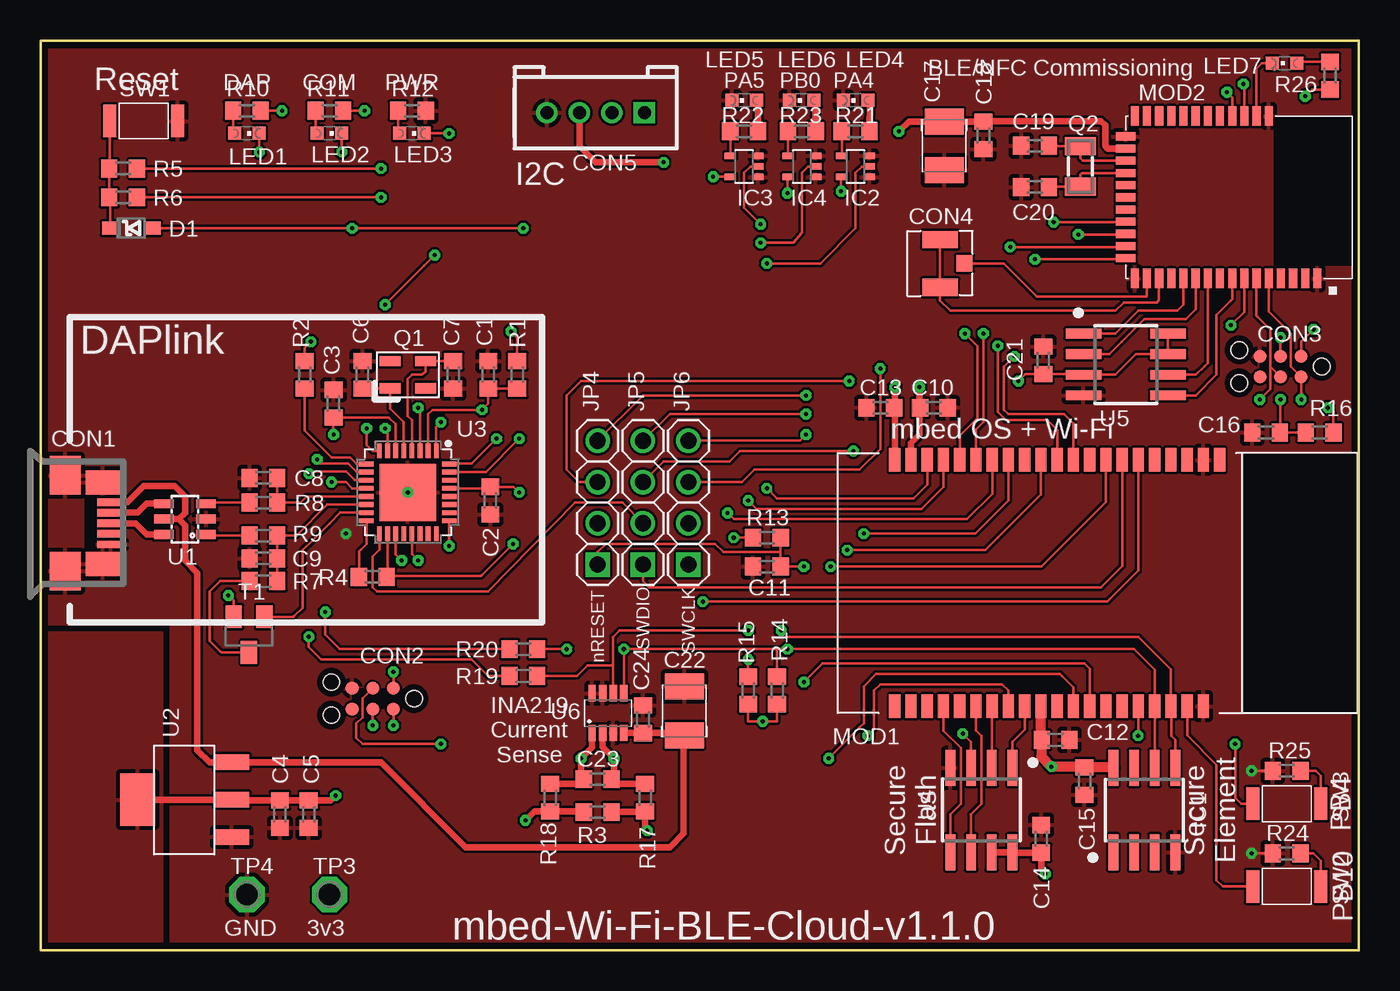
[diagram p4: board, top side]
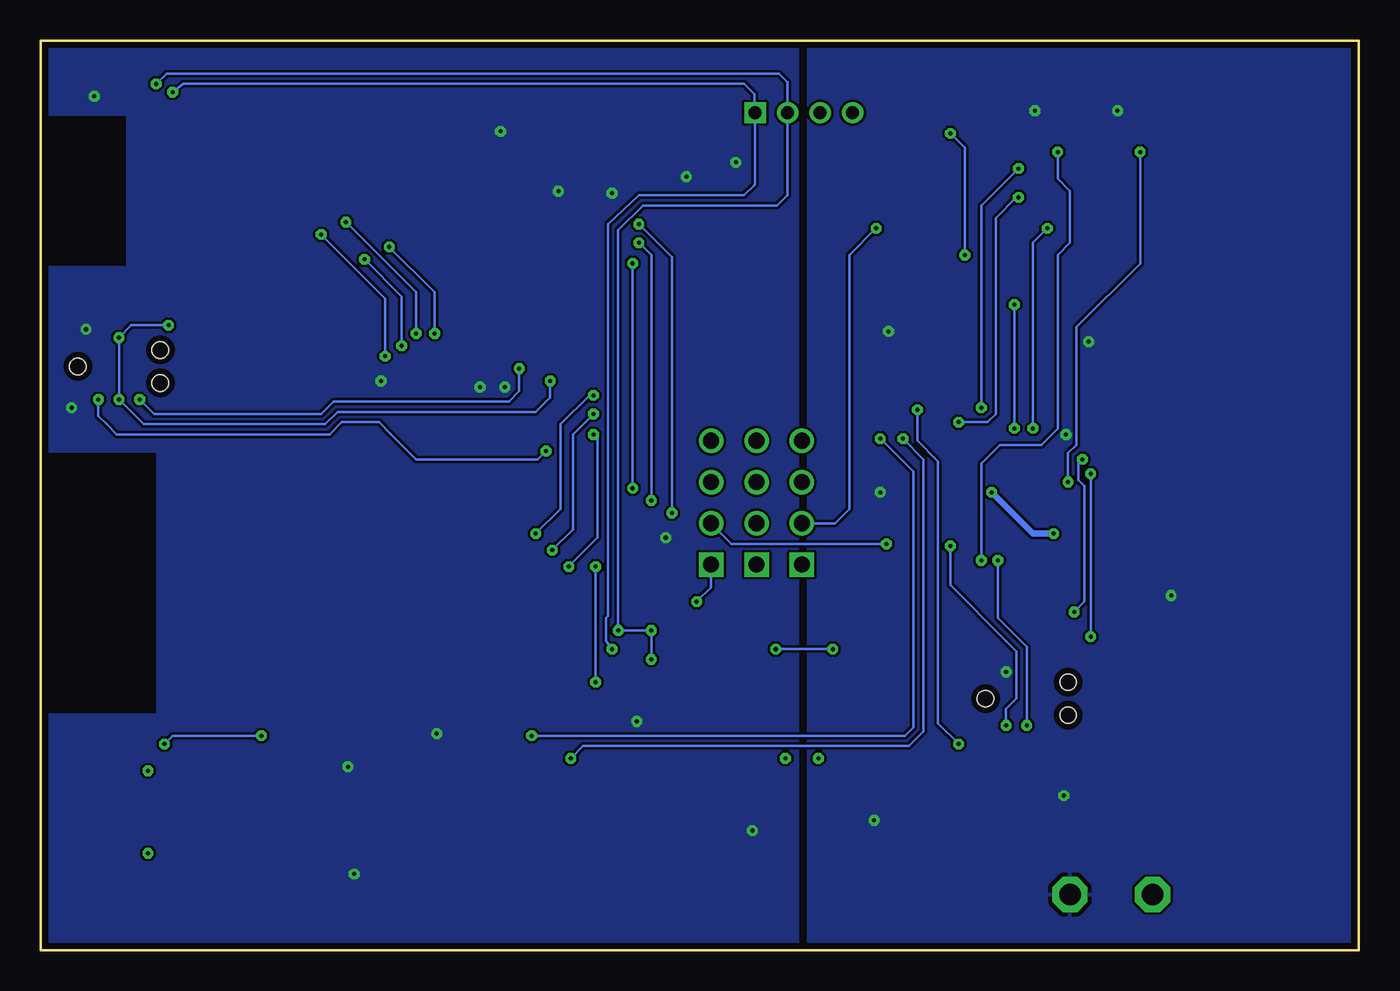
[diagram p5: board, bottom side, seen from below]

Size 81.15 x 56.01 mm. Coordinates in mm from the lower left corner, seen from the top.
Outline: 0,0 0,56.01 81.15,56.01 81.15,0 0,0
Copper layers ((1*16)): Top 0.035mm / dielectric 0.8mm / Bottom 0.035mm
Design rules "mbed-HDK-6-6-2-layer": minimum track width 6mil, minimum drill 9mil, track to track 6mil, track to pad 6mil, pad to pad 6mil, via to via 6mil, smd to smd 6mil, copper to edge 15mil, drill to drill 8mil, minimum pad ring 10mil, minimum via ring 8mil, stop-mask expansion 4mil, vias tented up to drill 0mil, thermal gap 10mil

### Footprints (pad centres in the part's own frame; a part is rotated, then mirrored left to right if it is on the bottom)
0603 = smd 1 x 1.1: 1 -0.85,0; 2 0.85,0
SMC_B = smd 1.6 x 2.4: + -1.5,0; - 1.5,0
USB-MICRO-B-H = smd 1.7 x 0.45: 4 2.8,-0.65; D+ 2.8,0; D- 2.8,0.65; GND 2.8,-1.3; VBUS 2.8,1.3 | smd 1.9 x 2.375: GND1 0,2.95; GND4 0,-2.95 | smd 2.1 x 1.475: GND2 2.3,2.5; GND3 2.3,-2.5
TC2030-CTX-NL = smd 0.787 x 0.787: 1 -1.27,-0.635; 2 -1.27,0.635; 3 0,-0.635; 4 0,0.635; 5 1.27,-0.635; 6 1.27,0.635 | hole 0.991: -2.54,0; 2.54,1.016; 2.54,-1.016
U.FL-R-SMT-1 = smd 1.05 x 2.2: GND1 -1.475,0; GND2 1.475,0 | smd 1 x 1: RF 0,-1.5
HW4-2.0 = drill 0.8 pad 1.27 square: 1 -3,0 | drill 0.8 pad 1.27: 2 -1,0; 3 1,0; 4 3,0
SOD323 = smd 1 x 0.8: A 1.3,0; K -1.3,0
SO8 = smd 0.6 x 2.2: 1 -1.905,-2.6; 2 -0.635,-2.6; 3 0.635,-2.6; 4 1.905,-2.6; 5 1.905,2.6; 6 0.635,2.6; 7 -0.635,2.6; 8 -1.905,2.6
SC70-5 = smd 0.4 x 0.7: 1 -0.65,-0.85; 2 0,-0.85; 3 0.65,-0.85; 4 0.65,0.85; 5 -0.65,0.85
1X04 = drill 1 square: 1 -3.81,0 | drill 1: 2 -1.27,0; 3 1.27,0; 4 3.81,0
CHIPLED_0603 = smd 0.8 x 0.8: A 0,-0.75; C 0,0.75
EMW3166 = smd 0.7 x 1.45: 1 0,7.585; 2 -1,7.585; 3 -2,7.585; 4 -3,7.585; 5 -4,7.585; 6 -5,7.585; 7 -6,7.585; 8 -7,7.585; 9 -8,7.585; 10 -9,7.585; 11 -10,7.585; 12 -11,7.585; 13 -12,7.585; 14 -13,7.585; 15 -14,7.585; 16 -15,7.585; 17 -16,7.585; 18 -17,7.585; 19 -18,7.585; 20 -19,7.585; 21 -19,-7.585; 22 -18,-7.585; 23 -17,-7.585; 24 -16,-7.585; 25 -15,-7.585; 26 -14,-7.585; 27 -13,-7.585; 28 -12,-7.585; 29 -11,-7.585; 30 -10,-7.585; 31 -9,-7.585; 32 -8,-7.585; 33 -7,-7.585; 34 -6,-7.585; 35 -5,-7.585; 36 -4,-7.585; 37 -3,-7.585; 38 -2,-7.585; 39 -1,-7.585; 40 0,-7.585; 41 -20,-7.585
BL652 = smd 1.2 x 0.5: 1 5,11.8; 2 5,11.05; 3 5,10.3; 4 5,9.55; 5 5,8.8; 6 5,8.05; 7 5,7.3; 8 5,6.55; 9 5,5.8; 10 5,5.05; 11 5,4.3; 12 5,3.55; 13 5,2.8; 14 5,2.05; 15 5,1.3; 16 5,0.55; 28 -5,0.55; 29 -5,1.3; 30 -5,2.05; 31 -5,2.8; 32 -5,3.55; 33 -5,4.3; 34 -5,5.05; 35 -5,5.8; 36 -5,6.55; 37 -5,7.3; 38 -5,8.05; 39 -5,8.8 | smd 0.5 x 1.2: 17 3.75,0; 18 3,0; 19 2.25,0; 20 1.5,0; 21 0.75,0; 22 0,0; 23 -0.75,0; 24 -1.5,0; 25 -2.25,0; 26 -3,0; 27 -3.75,0
3.2X2.5 = smd 1.27 x 0.635: P$1 -1.092,-0.838; P$2 1.092,-0.838; P$3 1.092,0.838; P$4 -1.092,0.838
FC135 = smd 1.1 x 1.9: X1 -1.25,0; X2 1.25,0
SKRKAEE010 = smd 0.8 x 2: P$1 -2.1,0; P$2 2.1,0
SOT23-3 = smd 1 x 1.4: 1 -0.95,-1.1; 2 0.95,-1.1; 3 0,1.1
P1-13 = drill 1.321 pad 2.159 octagon: TP 0,0
SOT23-6L = smd 0.55 x 1.2: 1 -0.95,-1.3; 2 0,-1.3; 3 0.95,-1.3; 4 0.95,1.3; 5 0,1.3; 6 -0.95,1.3
SOT223 = smd 0.95 x 2.15: 1 -2.3,-5.8; 2 0,-5.8; 3 2.3,-5.8 | smd 3.25 x 2.15: 4 0,0
SOT617-3 = smd 0.9 x 0.29: 1 -2.55,1.75; 2 -2.55,1.25; 3 -2.55,0.75; 4 -2.55,0.25; 5 -2.55,-0.25; 6 -2.55,-0.75; 7 -2.55,-1.25; 8 -2.55,-1.75; 17 2.55,-1.75; 18 2.55,-1.25; 19 2.55,-0.75; 20 2.55,-0.25; 21 2.55,0.25; 22 2.55,0.75; 23 2.55,1.25; 24 2.55,1.75 | smd 0.29 x 0.9: 9 -1.75,-2.55; 10 -1.25,-2.55; 11 -0.75,-2.55; 12 -0.25,-2.55; 13 0.25,-2.55; 14 0.75,-2.55; 15 1.25,-2.55; 16 1.75,-2.55; 25 1.75,2.55; 26 1.25,2.55; 27 0.75,2.55; 28 0.25,2.55; 29 -0.25,2.55; 30 -0.75,2.55; 31 -1.25,2.55; 32 -1.75,2.55 | smd 3.5 x 3.5: 33 0,0
SOT23-8 = smd 1 x 0.45: 1 -1.225,0.975; 2 -1.225,0.325; 3 -1.225,-0.325; 4 -1.225,-0.975; 5 1.225,-0.975; 6 1.225,-0.325; 7 1.225,0.325; 8 1.225,0.975

### Placement (x,y rotation side)
C1  27.56,35.43 90 top
C2  27.69,27.69 270 top
C3  18.03,33.66 90 top
C4  14.73,8.38 270 top
C5  16.51,8.38 270 top
C6  19.81,35.43 90 top
C7  25.4,35.43 270 top
C8  13.72,29.08 180 top
C9  13.72,24.13 180 top
C10  54.99,33.4 0 top
C11  44.7,23.62 180 top
C12  62.48,12.95 0 top
C13  51.69,33.4 180 top
C14  61.59,6.86 90 top
C15  64.26,10.41 270 top
C16  75.44,31.88 180 top
C17  55.63,49.53 270 top
C18  58.04,50.17 270 top
C19  61.21,49.53 180 top
C20  61.21,46.99 180 top
C21  61.72,36.32 90 top
C22  39.62,14.73 90 top
C23  34.29,10.54 0 top
C24  37.08,14.22 270 top
CON1  1.52,26.29 0 top
CON2  20.45,15.49 180 top
CON3  76.33,35.94 180 top
CON4  55.37,42.29 90 top
CON5  34.16,51.56 180 top
D1  5.59,44.45 0 top
IC1  67.94,8.64 0 top
IC2  50.16,48.26 90 top
IC3  43.31,48.26 90 top
IC4  46.86,48.26 90 top
JP4  34.29,27.56 90 top
JP5  37.08,27.56 90 top
JP6  39.88,27.56 90 top
LED1  12.7,50.29 270 top
LED2  17.78,50.29 270 top
LED3  22.86,50.29 270 top
LED4  50.16,52.32 90 top
LED5  43.31,52.32 90 top
LED6  46.86,52.32 90 top
LED7  76.58,54.61 90 top
MOD1  52.58,22.61 180 top
MOD2  66.8,46.36 270 top
Q1  22.61,35.43 0 top
Q2  64.01,48.26 270 top
R1  29.34,35.43 90 top
R2  16.26,35.43 270 top
R3  34.29,8.51 0 top
R4  20.45,22.99 180 top
R5  5.08,48.13 180 top
R6  5.08,46.36 180 top
R7  13.72,22.73 0 top
R8  13.72,27.56 0 top
R9  13.72,25.53 0 top
R10  12.7,51.69 0 top
R11  17.78,51.69 0 top
R12  22.86,51.69 0 top
R13  44.7,25.4 180 top
R14  45.34,16 270 top
R15  43.56,16 270 top
R16  78.74,31.88 0 top
R17  37.21,9.4 270 top
R18  31.37,9.4 270 top
R19  29.72,16.89 0 top
R20  29.72,18.54 0 top
R21  50.16,50.42 0 top
R22  43.31,50.42 0 top
R23  46.86,50.42 0 top
R24  76.71,5.97 0 top
R25  76.71,11.05 0 top
R26  79.38,53.85 270 top
SS1  31.75,33.78 0 top
SW1  6.35,51.05 180 top
SW2  76.71,3.94 0 top
SW3  76.71,9.02 0 top
T1  12.83,19.43 180 top
TP3  17.78,3.43 0 top
TP4  12.7,3.43 0 top
U1  8.89,26.54 90 top
U2  5.97,9.27 90 top
U3  22.61,28.19 270 top
U4  57.91,8.64 180 top
U5  66.8,36.07 270 top
U6  34.92,14.61 90 top

### Tracks (layer width: path | path; a pad name or v marks a point on that pad's centre or on a via)
+3.3V_IF  (via drill 0.25)
  Top 0.152: CON2.1 v21.72,17.15 | R10.2 v14.86,51.69 | R11.2 v19.94,51.69 | R1.2 29.34,37.72 v28.96,38.1 | v29.46,28.19 29.12,28.54 C2.1 27.59,28.44 U3.29 | U3.6 21.84,30.76 21.84,32.39 21.46,32.77 21.42,32.8 C3.1 18,31.79 v18.03,31.75 | R2.1 16.26,37.08 v16.64,37.47 | T1.2 11.88,21.52 v11.56,21.84
  Top 0.406: v18.16,9.53 17.87,9.23 C5.1 C4.1 11.81,9.23 U2.2 U2.4 | v29.84,8 30.39,8.55 R18.2 33.4,8.55 R3.1
  pour Bottom: 33.91,-0.38 33.91,56.01 0,56.01 0,-0.38
  pour Top: 7.49,-0.38 7.49,19.56 0,19.56 0,-0.38
+3.3V_TGT  (via drill 0.25)
  Top 0.152: U4.3 57.28,12.83 v56.77,13.34 | R15.2 43.56,14.1 v44.45,14.1 45.34,14.1 R14.2 | v60.2,35.05 60.62,35.47 C21.1 64.16,35.47 U5.3 66.17,35.43 67.44,36.7 U5.7 U5.8 | CON3.1 77.6,37.47 v78.36,38.23 | R16.2 79.59,33.06 v79.25,33.4 | R13.2 v42.67,25.4 | R26.2 78.27,53 v77.85,52.58 | v41.4,47.62 42.46,47.62 IC3.5 | IC4.5 45.97,47.61 v45.97,46.61 | IC2.5 49.28,47.61 v49.28,46.74
  Top 0.406: MOD1.39 53.58,31.23 54.1,31.75 54.1,33.11 | 54.1,33.11 C10.1 | 52.58,33.36 v52.58,34.67 | 54.1,33.11 v54.1,34.67 | MOD1.40 52.58,33.36 | 52.58,33.36 C13.1 | v61.85,4.7 61.59,4.95 C14.1 59.84,6.01 U4.8 U4.7 | MOD2.26 65.71,49.36 65.53,49.53 65.53,50.8 65.28,51.05 64.26,51.05 58.08,51.05 C18.1 55.64,51.02 C17.+ 53.44,51.03 v52.83,50.42 | R17.2 37.21,7.49 v37.34,7.37 | 37.17,8.51 R17.2 | R3.2 37.17,8.51 | 37.17,8.51 R17.2 | CON5.3 33.16,49.51 34.16,48.51 v38.35,48.51
  Top 0.61: MOD1.10 61.58,13.01 C12.1 61.59,12.92 61.59,11.94 v62.23,11.3 64.22,11.3 C15.1 66.01,11.26 IC1.8
  pour Bottom: 34.54,-0.38 81.28,-0.38 81.28,56.01 34.54,56.01
+5V
  Top 0.406: U6.4 C24.2 | C24.2 | C24.2 39.58,13.38 39.62,13.33 39.58,13.37 39.58,7.2 38.73,6.35 38.1,6.35 27.3,6.35 26.16,6.35 20.95,11.56 12.32,11.56 | 12.32,11.56 11.78,11.56 U2.3 | CON1.VBUS 5.36,27.59 5.71,27.94 6.35,28.58 8,28.58 8.26,28.58 8.89,27.94 8.89,26.92 8.51,26.54 | 8.51,26.54 U1.5 | 8.51,26.54 8.89,26.16 8.89,25.65 8.89,24 9.65,23.24 9.65,12.32 10.41,11.56 12.32,11.56
BL652_CTS/EMW3166_RTS  (via drill 0.25)
  Top 0.152: MOD1.36 56.58,31.69 57.66,32.77 57.66,36.2 57.66,37.21 v56.9,37.97 | v59.69,43.31 66.75,43.31 MOD2.18
  Bottom 0.152: v56.9,37.97 56.9,40.51 v59.69,43.31
BL652_RTS/EMW3166_CTS  (via drill 0.25)
  Top 0.152: MOD1.35 57.58,32.05 58.04,32.51 58.04,36.2 v58.04,37.97 | v62.36,44.83 66.78,44.83 MOD2.20
  Bottom 0.152: v58.04,37.97 58.04,40.51 v62.36,44.83
BL652_RX/EMW3166_TX  (via drill 0.25)
  Top 0.152: MOD1.30 62.58,32.04 61.98,32.64 59.44,32.64 58.93,33.15 v58.93,37.21 | v61.21,42.55 66.74,42.55 MOD2.17
  Bottom 0.152: v58.93,37.21 58.93,40.26 v61.21,42.55
BL652_TX/EMW3166_RX  (via drill 0.25)
  Top 0.152: MOD1.29 63.58,32.43 62.99,33.02 59.56,33.02 59.31,33.27 59.31,35.69 59.31,35.94 v59.94,36.58 | v63.88,44.07 66.77,44.07 MOD2.19
  Bottom 0.152: v59.94,36.58 59.94,40.13 v63.88,44.07
FLASH_CS
  Top 0.152: U4.1 59.82,12.83 60.58,13.59 MOD1.9
FLASH_MISO
  Top 0.152: U4.2 58.55,14.99 MOD1.7
  Top 0.406: 58.55,14.99 MOD1.7
FLASH_MOSI
  Top 0.152: U4.5 56.01,8.38 56.64,9.02 56.64,12.45 55.58,13.51 MOD1.4
FLASH_SCK
  Top 0.152: U4.6 57.28,8.38 57.91,9.02 57.91,13.21 57.58,13.54 MOD1.6
GND  (via drill 0.25)
  Top 0.152: R25.1 v74.55,11.05 | R24.1 v74.55,5.97
  Bottom 0.406: U3.33 20.07,25.65 v18.8,25.65
  other vias: 22.61,28.19
  pour Top: 8,-0.38 81.28,-0.38 81.28,56.01 0,56.01 0,20.07 8,20.07
I2C_SDA  (via drill 0.25)
  Top 0.152: IC1.5 69.85,12.95 69.6,13.21 69.6,15 MOD1.18 69.58,17.29 67.56,19.3 45.97,19.3 v45.59,19.69 | U6.6 35.25,17.53 | 35.25,17.53 35.25,19.3 35.63,19.69 v43.56,19.69 | R19.2 33.02,16.89 33.66,17.53 35.25,17.53 | R15.1 v43.56,17.91 | MOD2.37 74.1,53.28 v74.04,53.34
  Bottom 0.152: v43.56,17.91 43.56,18.92 v43.56,19.69 v45.59,19.69 45.59,41.02 45.59,44.32 44.07,45.85 35.81,45.85 35.18,46.48 35.18,51.55 CON5.2 | 35.16,51.45 CON5.2 | v74.04,53.34 73.41,53.98 52.82,53.98 35.69,53.98 35.16,53.45 CON5.2
IC2_SCL  (via drill 0.25)
  Top 0.152: IC1.6 MOD1.17 68.58,17.27 67.31,18.54 49.02,18.54 v45.97,18.54 45.72,18.54 45.34,18.54 | U6.5 v35.9,18.54 36.96,18.54 45.34,18.54 | R20.2 v32.38,18.54 | R14.1 45.34,18.54 | MOD2.36 73.35,52.51 v73.03,52.83
  Bottom 0.152: v32.38,18.54 v35.9,18.54 | v73.03,52.83 72.39,53.34 37.85,53.34 37.21,52.7 CON5.1 | v45.97,18.54 46.35,19.05 46.35,20.45 46.23,20.57 46.23,41.78 46.23,44.7 44.32,46.48 37.85,46.48 37.21,47.12 37.16,47.17 CON5.1 | 37.16,50.85 CON5.1
IF_NRESET  (via drill 0.25)
  Top 0.152: R1.1 C1.1 27.56,33.66 v27.18,33.27 24.13,33.27 23.86,33 U3.2 | v24.64,12.7 19.81,12.7 19.43,13.08 19.43,13.97 19.81,14.35 19.81,15.49 CON2.3
  Bottom 0.152: v27.18,33.27 27.18,31.37 25.91,30.1 25.91,13.97 v24.64,12.7
IF_SCL  (via drill 0.25)
  Top 0.152: R20.1 25.53,18.54 18.41,18.54 17.53,19.43 v17.53,20.83 | U3.10 19.45,29.44 18.92,29.97 17.27,29.97 v17.02,30.23
  Bottom 0.152: v17.02,30.23 17.27,29.97 17.27,29.34 17.27,28.96 16.89,28.58 16.89,21.46 v17.53,20.83
IF_SDA  (via drill 0.25)
  Top 0.152: R19.1 28.07,16.89 27.56,16.89 26.54,17.91 17.27,17.91 16.51,18.67 v16.51,19.3 | U3.11 19.32,28.94 18.8,29.46 16.64,29.46 v16.51,29.34
  Bottom 0.152: v16.51,29.34 v16.51,19.3
IF_SWCLK  (via drill 0.25)
  Top 0.152: U3.19 21.86,24.37 v22.23,24 | v20.45,13.84 CON2.4
  Bottom 0.152: v22.23,24 22.23,20.45 20.45,18.67 v20.45,13.84
IF_SWDIO  (via drill 0.25)
  Top 0.152: CON2.2 v21.72,13.84 | v25.15,24.89 25.16,24.9 U3.25
  Bottom 0.152: v21.72,13.84 CON2.2 21.08,15.49 21.08,18.42 21.72,19.05 25.15,22.48 v25.15,24.89
LED_COM_GREEN  (via drill 0.25)
  Top 0.152: U3.21 22.86,24.39 v23.24,24 | LED2.C 18.53,49.16 v18.54,49.15
  Bottom 0.152: v18.54,49.15 18.54,47.5 17.78,46.74 17.78,43.56 18.54,42.8 18.54,32.13 19.56,31.12 22.1,31.12 23.24,29.97 v23.24,24
LED_DAP_BLUE  (via drill 0.25)
  Top 0.152: LED1.C 13.45,49.16 v13.46,49.15 | U3.12 19.18,28.44 18.8,28.83 v17.91,28.83
  Bottom 0.152: v13.46,49.15 13.46,42.29 17.4,38.35 17.4,31.12 17.91,30.61 v17.91,28.83
LED_PWR_RED  (via drill 0.25)
  Top 0.152: U3.7 21.36,31.98 v21.21,32.13 | v21.21,39.75 23.62,42.16 v24.26,42.8 | 23.62,50.28 LED3.C v25.15,50.29
  Bottom 0.152: v21.21,32.13 v21.21,39.75 | v24.26,42.8 24.26,49.4 v25.15,50.29
N$1
  Top 0.152: MOD2.15 68.1,40.29 68.07,40.26 61.34,40.26 59.31,42.29 CON4.RF
N$2
  Top 0.406: R22.2 44.16,52.22 LED5.A
N$3
  Top 0.152: C7.1 25.39,36.27 Q1.P$3 23.7,35.64 23.5,35.43 22.86,35.43 22.61,35.18 22.61,32.89 22.86,32.64 U3.4
N$4
  Top 0.152: R23.1 IC4.4
N$5
  Top 0.406: R23.2 47.71,52.22 LED6.A
N$6
  Top 0.152: MOD2.14 68.85,40.02 68.71,39.88 66.67,39.88 66.17,39.37 61.34,39.37 56.01,39.37 55.37,40.01 CON4.GND1 CON4.GND2
N$7
  Top 0.152: R26.1 77.42,54.7 LED7.A
N$8
  Top 0.152: MOD2.38 74.85,54.28 75.18,54.61 LED7.C
N$9
  Top 0.152: R22.1 IC3.4
N$10
  Top 0.152: R7.1 11.05,22.73 10.41,22.1 10.41,19.05 11.05,18.42 11.13,18.33 T1.3
N$11
  Top 0.152: R21.1 IC2.4
N$12
  Top 0.406: CON1.D+ 5.84,26.29 6.48,25.65 6.54,25.59 U1.6
N$13
  Top 0.406: CON1.D- 5.98,26.94 6.48,27.43 6.54,27.49 U1.4
N$14
  Top 0.406: R21.2 51.04,52.3 LED4.A
N$15  (via drill 0.25)
  Top 0.406: U6.2 34.6,12.52 v35.31,11.81 35.31,10.71 C23.2 35.43,10.25 R17.1
N$17  (via drill 0.25)
  Top 0.406: U6.1 33.95,12.49 v33.27,11.81 33.27,10.71 C23.1 33.15,10.25 R18.1
N$18
  Top 0.152: C6.1 21.5,34.58 Q1.P$1 21.51,33.35 22.35,32.51 U3.5
N$19
  Top 0.152: MOD2.24 64.11,47.86 64.01,47.75 Q2.X2 62.08,47.01 C20.1
N$20
  Top 0.152: MOD2.25 64.17,48.61 64.01,48.77 Q2.X1 62.08,49.51 C19.1
N$21
  Top 0.152: R2.2 16.26,33.27 16.26,33.02 16.26,32 17.91,30.35 19.05,30.35 19.43,29.97 19.46,29.94 U3.9
N$22
  Top 0.152: R25.2 78.49,11.05 78.81,10.73 SW3.P$2
N$23
  Top 0.152: R24.2 78.36,5.97 78.81,5.52 SW2.P$2
N$24
  Top 0.152: R11.1 16.93,50.39 LED2.A
N$25
  Top 0.152: R10.1 11.85,50.39 LED1.A
N$26
  Top 0.152: R12.1 22.01,50.39 LED3.A
PA4  (via drill 0.25)
  Top 0.152: MOD1.38 54.58,28.67 53.72,27.81 45.34,27.81 v44.7,28.45 | IC2.2 50.55,48.26 50.16,47.88 50.16,44.45 48.01,42.29 v44.7,42.29
  Bottom 0.152: v44.7,42.29 v44.7,28.45
PA5  (via drill 0.25)
  Top 0.152: MOD1.34 58.58,28.1 57.02,26.54 42.67,26.54 v42.29,26.92 | IC3.2 43.69,48.26 43.31,47.88 43.31,45.72 v44.32,44.7
  Bottom 0.152: v44.32,44.7 42.29,42.67 v42.29,26.92
PB0  (via drill 0.25)
  Top 0.152: MOD1.37 55.58,28.53 54.23,27.18 44.07,27.18 v43.56,27.69 | IC4.2 47.24,48.26 46.86,47.88 46.86,44.2 46.35,43.56 v44.32,43.56
  Bottom 0.152: v44.32,43.56 43.56,42.8 v43.56,27.69
PB4  (via drill 0.25)
  Top 0.152: SW3.P$1 73.91,9.02 73.53,9.4 v73.53,12.7 | MOD1.16 67.58,13.22 v67.56,13.21
  Bottom 0.152: v67.56,13.21 73.03,13.21 v73.53,12.7
PB10
  Top 0.152: SW2.P$1 72.77,3.94 72.39,4.32 72.39,11.43 70.58,13.24 MOD1.19
SFLASH_CS
  Top 0.152: MOD2.12 70.35,39.75 69.98,39.37 67.56,39.37 66.17,37.97 U5.1
SFLASH_MISO
  Top 0.152: MOD2.11 71.1,39.48 70.48,38.86 67.94,38.86 67.56,38.48 66.55,37.47 65.79,36.7 U5.2
SFLASH_MOSI
  Top 0.152: U5.5 71.12,34.16 72.39,35.43 72.39,39.12 73.28,40.01 73.35,40.08 MOD2.8
SFLASH_SCK
  Top 0.152: U5.6 71.12,35.43 71.63,35.94 71.85,36.16 MOD2.10
TGT_NRESET  (via drill 0.25)
  Top 0.152: U3.8 20.44,30.74 20.07,31.12 v20.07,32.13 | D1.A v19.18,44.45 v29.72,44.45
  Bottom 0.152: v20.07,32.13 20.07,43.56 v19.18,44.45 | v29.72,44.45 31.37,42.8 31.37,27.18 32.26,26.29 JP4.2
TGT_NRESET_BL652  (via drill 0.25)
  Top 0.152: MOD2.7 74.1,39.3 v73.28,38.48 | v76.33,33.91 76.33,31.92 C16.1 R16.1 | v76.33,37.72 CON3.3 | v49.78,35.05 33.27,35.05 32.38,34.16 32.38,29.59 33.15,28.83 JP4.3
  Bottom 0.152: v73.28,38.48 75.56,38.48 v76.33,37.72 v76.33,33.91 74.8,32.39 71.63,32.39 63.63,32.39 62.87,33.15 57.53,33.15 50.67,33.15 49.78,34.04 v49.78,35.05
TGT_NRESET_BUTTON
  Top 0.152: SW1.P$2 4.25,48.15 R5.2 R6.2 | R6.2 4.32,46.36 | D1.K 4.29,46.3 R6.2
TGT_NRESET_EMW3166  (via drill 0.25)
  Top 0.152: MOD1.13 64.58,17.34 64.26,17.65 61.85,17.65 48.13,17.65 v46.99,16.51 | R13.1 45.55,24.51 | 45.55,24.51 C11.1 v46.99,23.62 | 45.55,24.51 42.04,24.51 41.53,25.02 34.8,25.02 34.29,24.51 JP4.1
  Bottom 0.152: v46.99,16.51 v46.99,23.62
TGT_NRESET_FB  (via drill 0.25)
  Top 0.152: U3.3 23.36,33.29 v23.24,33.4 | v20.95,48.13 R5.1
  Bottom 0.152: v23.24,33.4 23.24,45.85 v20.95,48.13
TGT_NRESET_FB_ISP  (via drill 0.25)
  Top 0.152: U3.1 24.36,32.23 v24.64,32.51 | v20.95,46.36 R6.1
  Bottom 0.152: v24.64,32.51 22.86,32.51 22.35,33.02 22.35,45.09 21.08,46.36 v20.95,46.36
TGT_NRST_BL652_GPIO  (via drill 0.25)
  Top 0.152: MOD1.33 59.58,27.7 57.53,25.65 v50.67,25.65 | v47.12,34.16 37.08,34.16 JP4.4
  Bottom 0.152: v50.67,25.65 49.15,27.18 49.15,32.39 47.37,34.16 v47.12,34.16
TGT_RTS
  Top 0.152: U3.16 20.06,25.01 19.68,24.64 19.6,24.55 R4.2
TGT_RX  (via drill 0.25)
  Top 0.152: U3.32 25.18,29.97 26.16,29.97 26.54,29.97 v28.07,31.5 | MOD1.12 63.58,16.18 62.87,16.89 62.74,17.02 51.44,17.02 50.67,16.26 50.67,13.97 50.42,13.72 v48.51,11.81
  Bottom 0.152: v28.07,31.5 26.8,30.23 26.8,13.46 27.69,12.57 27.81,12.57 47.75,12.57 v48.51,11.81
TGT_SWCLK  (via drill 0.25)
  Top 0.152: 21.36,23.05 R4.1 21.36,23.05 | 21.36,23.05 27.11,23.05 27.18,23.11 v29.08,25.02 | 21.36,23.05 U3.18
  Bottom 0.152: v29.08,25.02 38.61,25.02 JP6.2
TGT_SWCLK_BL652  (via drill 0.25)
  Top 0.152: CON3.4 75.69,35.94 | 75.69,35.94 75.69,38.23 74.93,38.99 74.85,39.07 MOD2.6 | 75.69,35.94 75.69,34.54 v75.06,33.91 | v51.69,35.81 51.69,30.86 50.42,29.59 47.5,29.59 43.94,29.59 43.18,28.83 JP6.3
  Bottom 0.152: v75.06,33.91 74.17,33.02 71.63,33.02 63.88,33.02 63.12,33.78 57.66,33.78 53.34,33.78 52.32,33.78 51.69,34.42 v51.69,35.81
TGT_SWCLK_BL652_GPIO  (via drill 0.25)
  Top 0.152: MOD1.27 65.58,27.61 61.59,23.62 v48.64,23.62 | v47.12,31.75 46.74,31.37 JP6.4
  Bottom 0.152: v48.64,23.62 46.86,25.4 46.86,31.5 v47.12,31.75
TGT_SWCLK_EMW3166  (via drill 0.25)
  Top 0.152: MOD1.25 67.58,23.38 65.79,21.59 65.66,21.46 v40.77,21.46
  Bottom 0.152: v40.77,21.46 39.88,22.35 JP6.1
TGT_SWDIO
  Top 0.152: U3.17 20.86,24.67 20.45,24.26 20.45,22.35 20.7,22.1 27.56,22.1 32.89,27.56 35.81,27.56 JP5.2
TGT_SWDIO_BL652  (via drill 0.25)
  Top 0.152: MOD2.5 75.6,39.33 76.96,37.97 76.96,35.94 CON3.2 v77.6,33.91 | JP5.3 38.35,30.1 42.42,30.1 43.05,30.73 v50.04,30.73
  Bottom 0.152: v77.6,33.91 77.6,32.89 77.09,32.39 76.45,31.75 71.63,31.75 63.37,31.75 62.61,32.51 60.33,32.51 59.56,31.75 58.04,30.23 55.75,30.23 51.56,30.23 50.55,30.23 v50.04,30.73
TGT_SWDIO_BL652_GPIO  (via drill 0.25)
  Top 0.152: MOD1.31 61.58,28.05 58.93,25.4 58.17,24.64 v49.66,24.64 | v47.12,33.02 46.48,33.02 38.73,33.02 JP5.4
  Bottom 0.152: v49.66,24.64 48.39,25.91 48.39,31.75 v47.12,33.02
TGT_SWDIO_EMW3166
  Top 0.152: MOD1.26 66.58,23.65 65.28,22.35 38.48,22.35 37.47,22.35 37.08,22.73 JP5.1
TGT_TX  (via drill 0.25)
  Top 0.152: MOD1.8 59.58,15.99 59.18,16.38 51.69,16.38 51.31,16 51.31,13.59 v50.93,13.21 | U3.31 27.41,29.44 v29.46,31.5
  Bottom 0.152: v29.46,31.5 27.43,29.46 27.43,25.27 27.43,13.72 27.94,13.21 v50.93,13.21
USB-D+
  Top 0.152: U1.1 10.26,25.53 R9.1
USB-D-
  Top 0.152: U1.3 10.26,27.56 R8.1
USB-SCON
  Top 0.152: U3.15 18.43,26.94 17.78,26.29 16.76,25.27 16.13,24.64 16.13,21.08 15.62,20.57 15.58,20.53 T1.1
USB_DM
  Top 0.152: U3.13 16.39,27.94 16,27.56 R8.2 C8.1
USB_DP
  Top 0.152: U3.14 20.04,27.43 17.65,27.43 15.75,25.53 R9.2 C9.1 R7.2

### Text on the board
TopSilkscreen: BLE/NFC Commissioning | Reset | DAP | COM | PWR | PA5 | PB0 | PA4 | I2C | DAPlink | mbed OS + Wi-Fi | nRESET | SWDIO | SWCLK | INA219 / Current / Sense | PB4 | Secure / Flash | Secure / Element | PB10 | GND | 3v3 | mbed-Wi-Fi-BLE-Cloud-v1.1.0